# EAGLE design ATA (EAGLE 9.6.2)

## Sheet 1 of 2
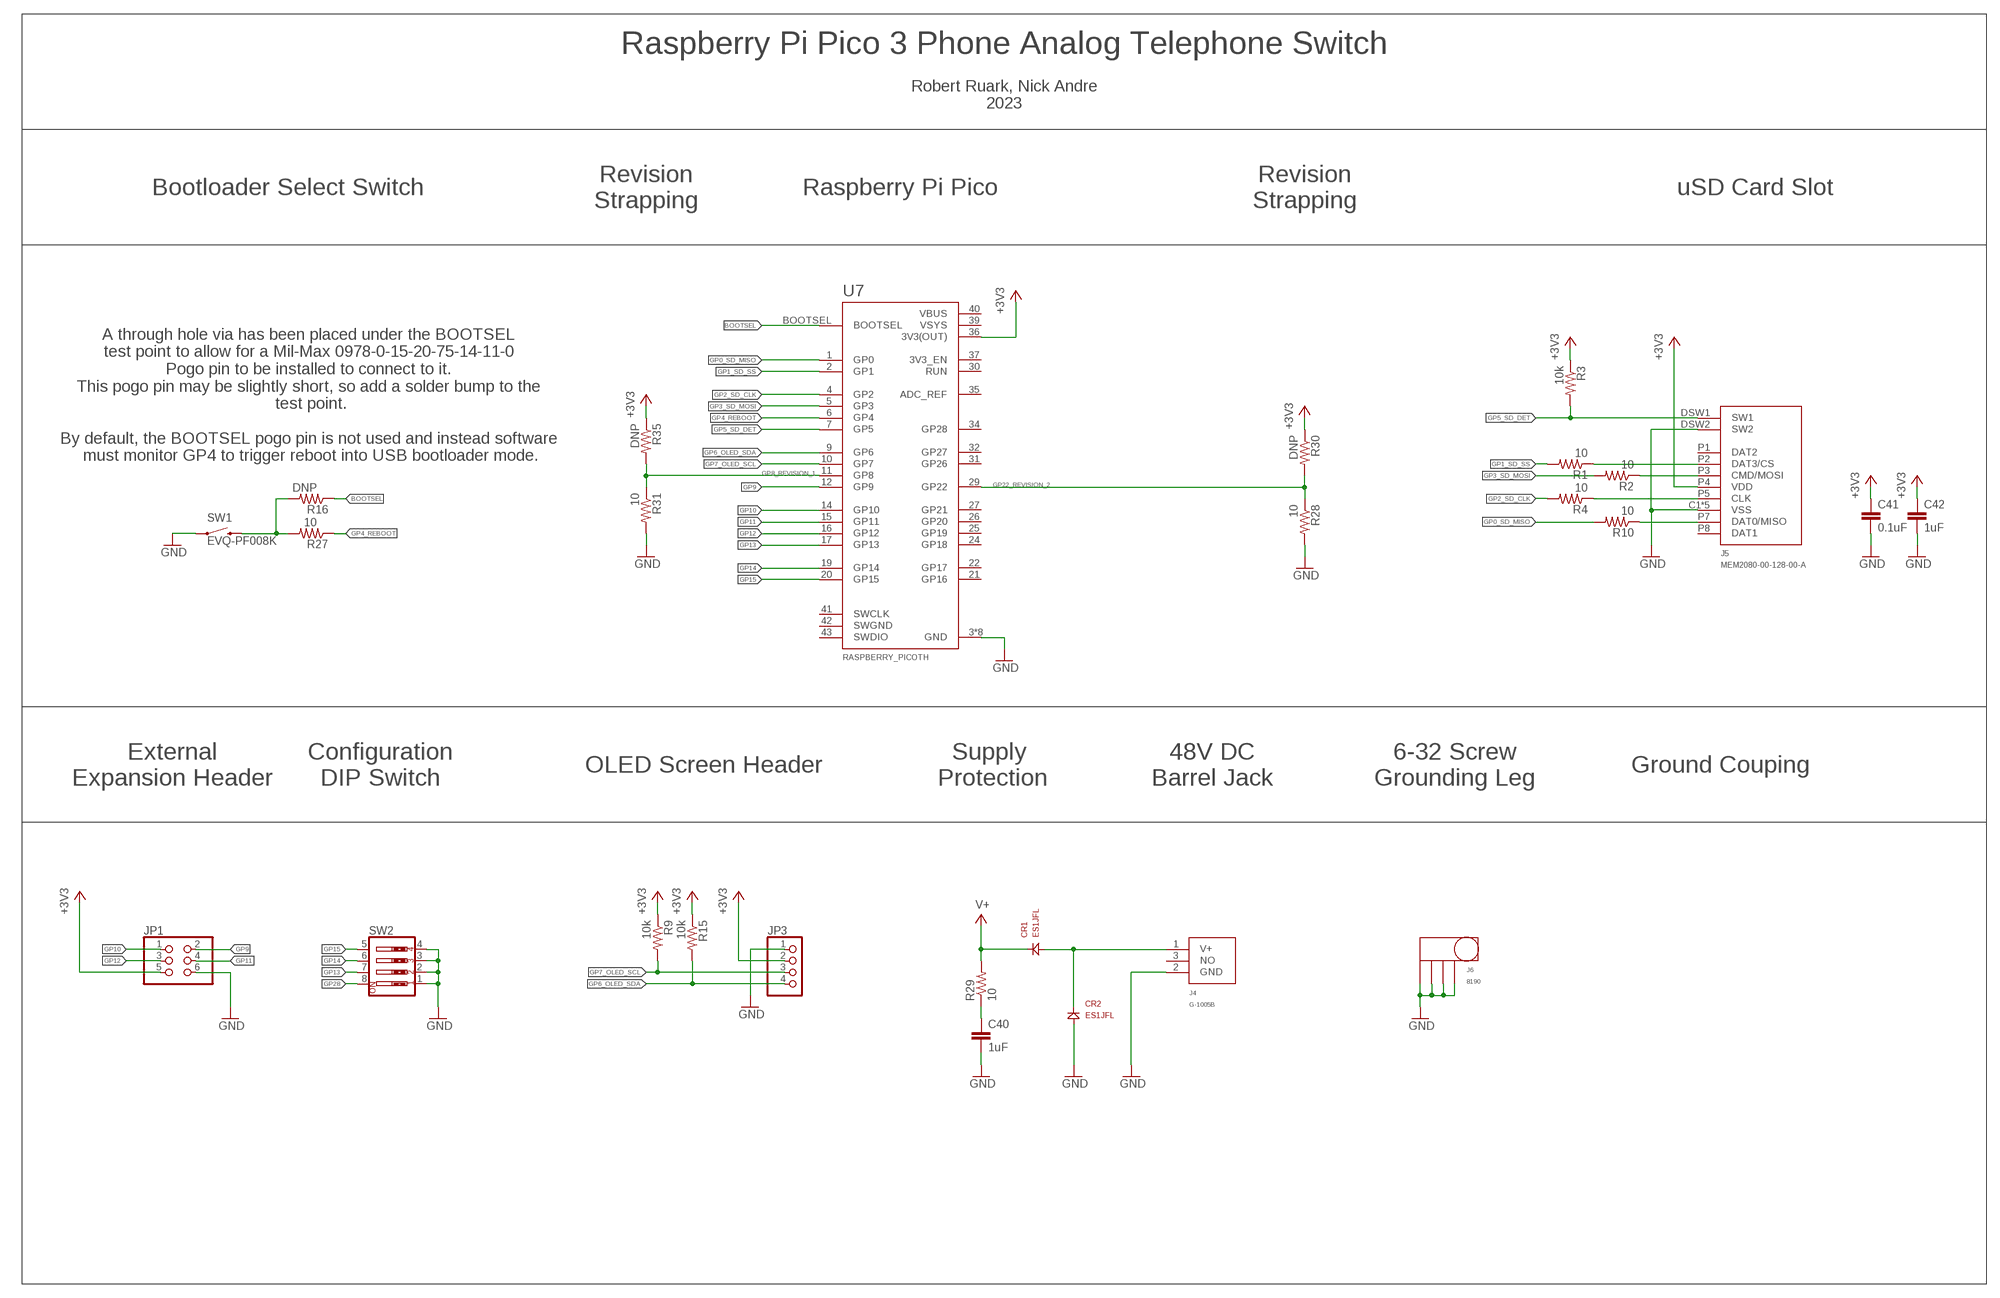
[diagram p0: schematic, sheet 1]

### Parts
C40  1uF  1206_CAPACITOR  [1206]
C41  0.1uF  0603_CAPACITOR  [0603]
C42  1uF  0805_CAPACITOR  [0805]
CR1  ES1JFL  [SOD123(AK)]
CR2  ES1JFL  [SOD123(AK)]
J4  G-1005B  [G-1005B]
J5  MEM2080-00-128-00-A  [MEM2080]
J6  8190  [7781]
JP1  PINHD-2X3/90  [2X03/90]
JP3  PINHD-1X4  [1X04]
R1  10  0603_RESISTOR  [0603]
R2  10  0603_RESISTOR  [0603]
R3  10k  0603_RESISTOR  [0603]
R4  10  0603_RESISTOR  [0603]
R9  10k  0603_RESISTOR  [0603]
R10  10  0603_RESISTOR  [0603]
R15  10k  0603_RESISTOR  [0603]
R16  DNP  0603_RESISTOR  [0603]
R27  10  0603_RESISTOR  [0603]
R28  10  0603_RESISTOR  [0603]
R29  10  1206_RESISTOR  [1206]
R30  DNP  0603_RESISTOR  [0603]
R31  10  0603_RESISTOR  [0603]
R35  DNP  0603_RESISTOR  [0603]
SW1  EVQ-PF008K  [EVQ-PF008K]
SW2  SW_DIP-4  [EDG-04]
U7  RASPBERRY_PICOTH  [PICO-PKG-TH]

### Nets
+3V3: C41.1 C42.1 J5.P4(VDD) JP1.5 JP3.2 R3.1 R9.1 R15.1 R30.1 R35.1 U7.36(3V3(OUT))
BOOTSEL: R16.1 U7.BOOTSEL
GND: C40.2 C41.2 C42.2 CR2.A J4.2(GND) J5.C1(VSS) J5.C2(VSS) J5.C3(VSS) J5.C4(VSS) J5.DSW2(SW2) J5.P6(VSS) J6.P$1 J6.P$2 J6.P$3 J6.P$4 JP1.6 JP3.1 R28.2 R31.2 SW1.S1 SW2.1 SW2.2 SW2.3 SW2.4 U7.3(GND) U7.8(GND) U7.13(GND) U7.18(GND) U7.23(GND) U7.28(GND) U7.33(GND) U7.38(GND) ; also sheet 2
GP0_SD_MISO: R10.2 U7.1(GP0)
GP1_SD_SS: R1.2 U7.2(GP1)
GP2_SD_CLK: R4.2 U7.4(GP2)
GP3_SD_MOSI: R2.2 U7.5(GP3)
GP4_REBOOT: R27.1 U7.6(GP4)
GP5_SD_DET: J5.DSW1(SW1) R3.2 U7.7(GP5)
GP6_OLED_SDA: JP3.4 R15.2 U7.9(GP6)
GP7_OLED_SCL: JP3.3 R9.2 U7.10(GP7)
GP8_REVISION_1: R31.1 R35.2 U7.11(GP8)
GP9: JP1.2 U7.12(GP9)
GP10: JP1.1 U7.14(GP10)
GP11: JP1.4 U7.15(GP11)
GP12: JP1.3 U7.16(GP12)
GP13: SW2.7 U7.17(GP13)
GP14: SW2.6 U7.19(GP14)
GP15: SW2.5 U7.20(GP15)
GP22_REVISION_2: R28.1 R30.2 U7.29(GP22)
GP28: SW2.8
N$19: R16.2 R27.2 SW1.S2
N$20: CR1.A CR2.K J4.1(V+)
N$25: J5.P5(CLK) R4.1
N$27: C40.1 R29.1
N$28: J5.P7(DAT0/MISO) R10.1
N$30: J5.P3(CMD/MOSI) R2.1
N$31: J5.P2(DAT3/CS) R1.1
V+: CR1.K R29.2
Unconnected: J4.3(NO) J5.P1(DAT2) J5.P8(DAT1) U7.21(GP16) U7.22(GP17) U7.24(GP18) U7.25(GP19) U7.26(GP20) U7.27(GP21) U7.30(RUN) U7.31(GP26) U7.32(GP27) U7.34(GP28) U7.35(ADC_REF) U7.37(3V3_EN) U7.41(SWCLK) U7.43(SWDIO)

### Notes on the sheet
- Raspberry Pi Pico 3 Phone Analog Telephone Switch
- Robert Ruark, Nick Andre
  2023
- Bootloader Select Switch
- Revision
  Strapping
- Raspberry Pi Pico
- Revision
  Strapping
- uSD Card Slot
- A through hole via has been placed under the BOOTSEL 
  test point to allow for a Mil-Max 0978-0-15-20-75-14-11-0 
  Pogo pin to be installed to connect to it. 
  This pogo pin may be slightly short, so add a solder bump to the 
  test point.
  
  By default, the BOOTSEL pogo pin is not used and instead software 
  must monitor GP4 to trigger reboot into USB bootloader mode.
- External
  Expansion Header
- Configuration
  DIP Switch
- OLED Screen Header
- Supply 
  Protection
- 48V DC
  Barrel Jack
- 6-32 Screw
  Grounding Leg
- Ground Couping

## Sheet 2 of 2
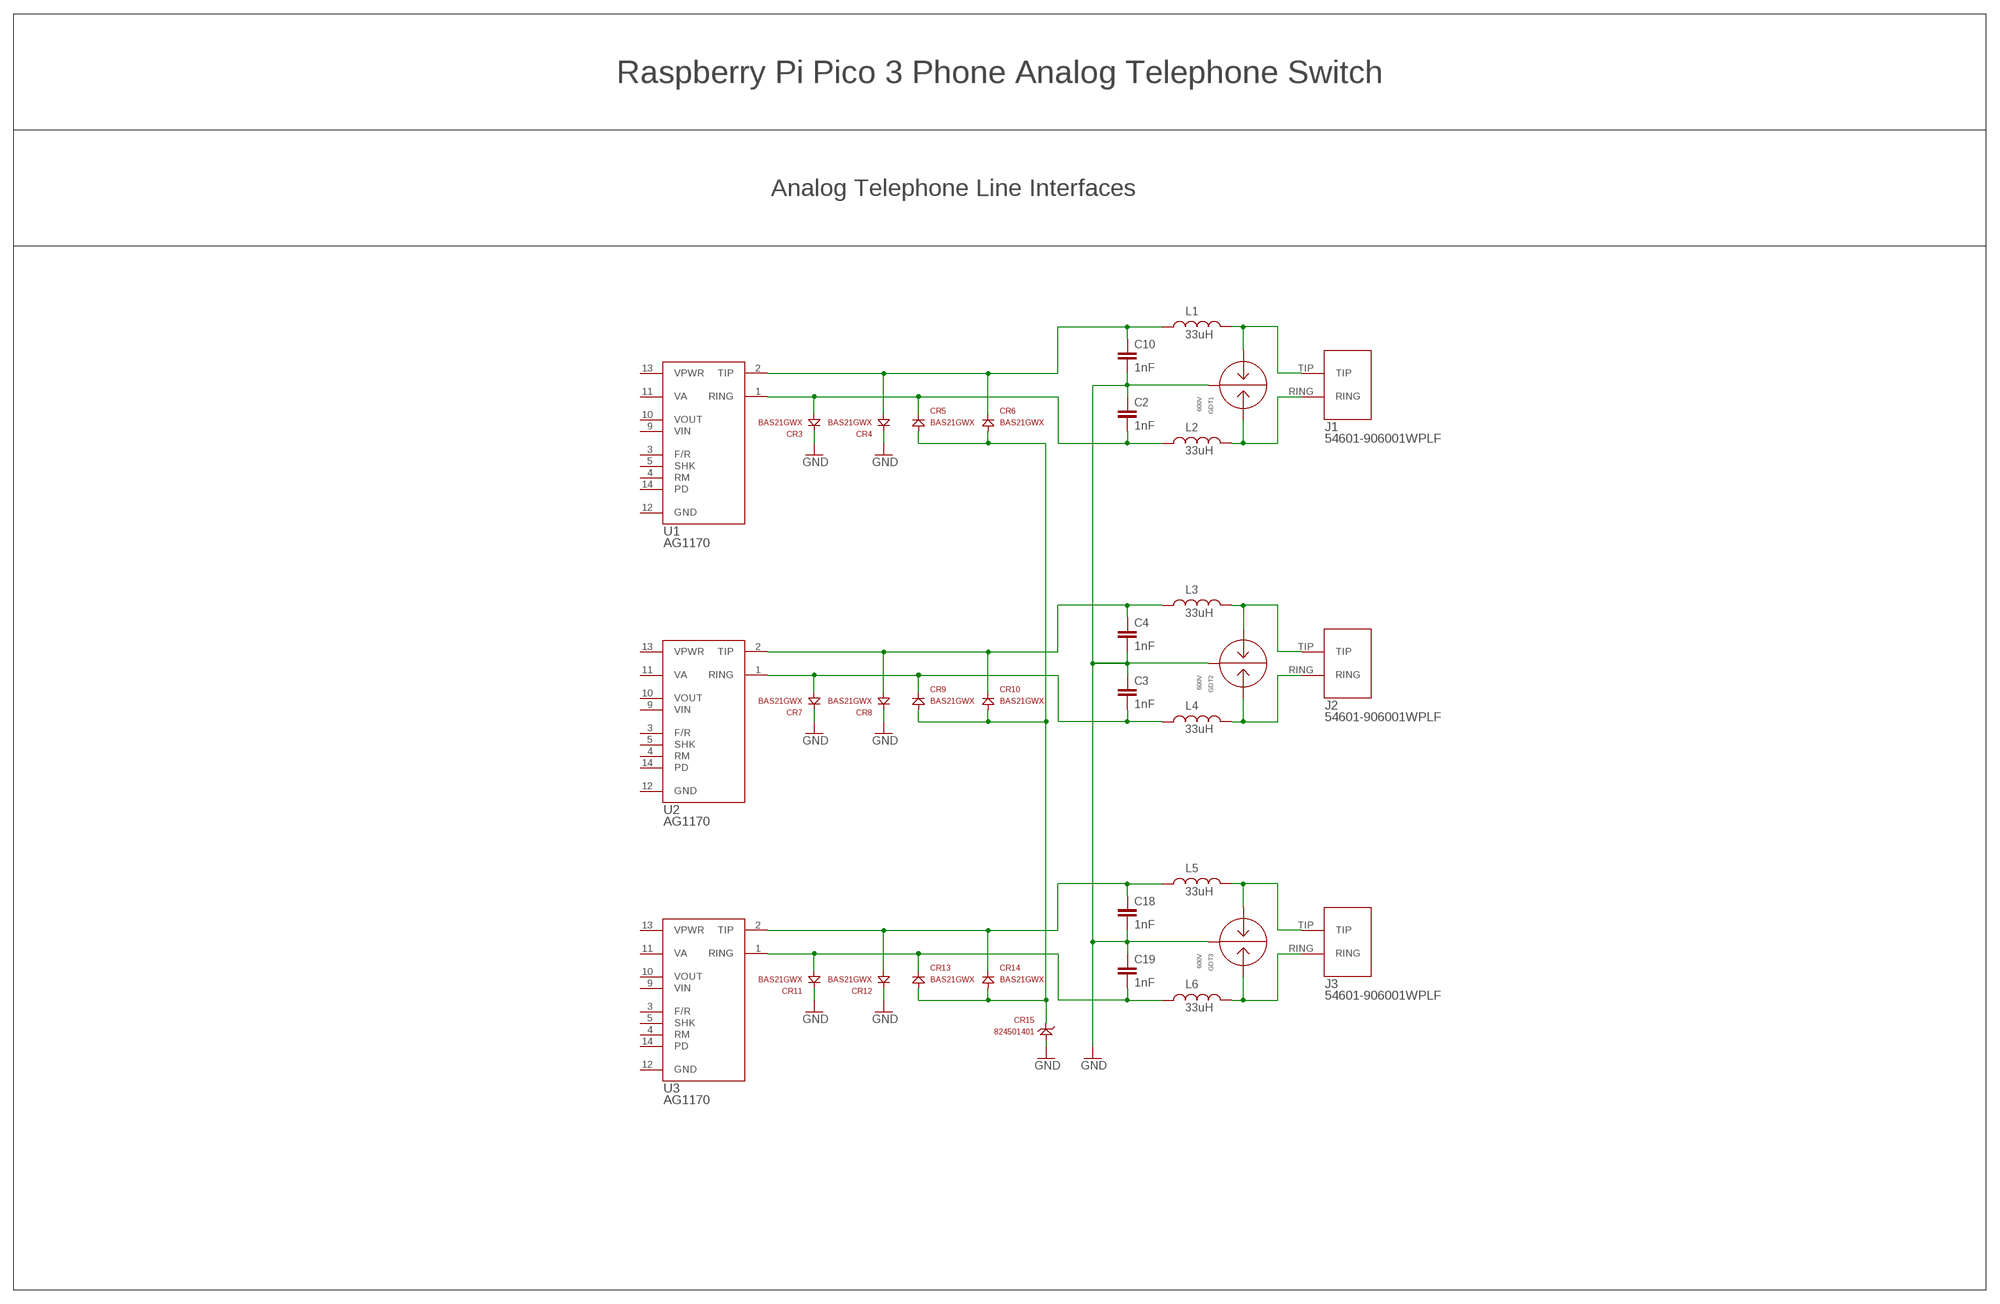
[diagram p1: schematic, sheet 2]

### Parts
C2  1nF  0805_CAPACITOR  [0805]
C3  1nF  0805_CAPACITOR  [0805]
C4  1nF  0805_CAPACITOR  [0805]
C10  1nF  0805_CAPACITOR  [0805]
C18  1nF  0805_CAPACITOR  [0805]
C19  1nF  0805_CAPACITOR  [0805]
CR3  BAS21GWX  [SOD123]
CR4  BAS21GWX  [SOD123]
CR5  BAS21GWX  [SOD123]
CR6  BAS21GWX  [SOD123]
CR7  BAS21GWX  [SOD123]
CR8  BAS21GWX  [SOD123]
CR9  BAS21GWX  [SOD123]
CR10  BAS21GWX  [SOD123]
CR11  BAS21GWX  [SOD123]
CR12  BAS21GWX  [SOD123]
CR13  BAS21GWX  [SOD123]
CR14  BAS21GWX  [SOD123]
CR15  824501401  [DO-214AC]
GDT1  600V  2036-60-SM-RPLF  [2036_GDT]
GDT2  600V  2036-60-SM-RPLF  [2036_GDT]
GDT3  600V  2036-60-SM-RPLF  [2036_GDT]
J1  54601-906001WPLF  [54601-906001WPLF]
J2  54601-906001WPLF  [54601-906001WPLF]
J3  54601-906001WPLF  [54601-906001WPLF]
L1  33uH  SDR0403-330KL  [SDR0403]
L2  33uH  SDR0403-330KL  [SDR0403]
L3  33uH  SDR0403-330KL  [SDR0403]
L4  33uH  SDR0403-330KL  [SDR0403]
L5  33uH  SDR0403-330KL  [SDR0403]
L6  33uH  SDR0403-330KL  [SDR0403]
U1  AG1170  [AG1170S]
U2  AG1170  [AG1170S]
U3  AG1170  [AG1170S]

### Nets
DNVT_1_SWITCH_RX_GREEN: GDT2.L2 J2.RING L4.2
DNVT_1_SWITCH_RX_GREEN-WHITE: GDT2.L1 J2.TIP L3.2
DNVT_1_SWITCH_TX_BLUE: GDT1.L2 J1.RING L2.2
DNVT_1_SWITCH_TX_BLUE-WHITE: GDT1.L1 J1.TIP L1.2
DNVT_2_SWITCH_TX_ORANGE: GDT3.L2 J3.RING L6.2
DNVT_2_SWITCH_TX_ORANGE-WHITE: GDT3.L1 J3.TIP L5.2
GND: C2.1 C3.1 C4.2 C10.2 C18.2 C19.1 CR3.1(K) CR4.1(K) CR7.1(K) CR8.1(K) CR11.1(K) CR12.1(K) CR15.A GDT1.C GDT2.C GDT3.C ; also sheet 1
N$1: C10.1 CR4.2(A) CR6.1(K) L1.1 U1.2(TIP)
N$2: C2.2 CR3.2(A) CR5.1(K) L2.1 U1.1(RING)
N$3: C4.1 CR8.2(A) CR10.1(K) L3.1 U2.2(TIP)
N$4: C3.2 CR7.2(A) CR9.1(K) L4.1 U2.1(RING)
N$12: CR5.2(A) CR6.2(A) CR9.2(A) CR10.2(A) CR13.2(A) CR14.2(A) CR15.C(K)
N$63: C18.1 CR12.2(A) CR14.1(K) L5.1 U3.2(TIP)
N$64: C19.2 CR11.2(A) CR13.1(K) L6.1 U3.1(RING)
Unconnected: U1.3(F/R) U1.4(RM) U1.5(SHK) U1.9(VIN) U1.10(VOUT) U1.11(VA) U1.12(GND) U1.13(VPWR) U1.14(PD) U2.3(F/R) U2.4(RM) U2.5(SHK) U2.9(VIN) U2.10(VOUT) U2.11(VA) U2.12(GND) U2.13(VPWR) U2.14(PD) U3.3(F/R) U3.4(RM) U3.5(SHK) U3.9(VIN) U3.10(VOUT) U3.11(VA) U3.12(GND) U3.13(VPWR) U3.14(PD)

### Notes on the sheet
- Raspberry Pi Pico 3 Phone Analog Telephone Switch
- Analog Telephone Line Interfaces

## Power pins joined to a net without a drawn wire
SWGND: U7.42(SWGND)
VBUS: U7.40(VBUS)
VSYS: U7.39(VSYS)

## Library data of the parts
C2-C4 C10 C18 C19 C42 = ruark2:0805_CAPACITOR: NO DEFINED PN
C40 = ruark2:1206_CAPACITOR: NO DEFINED PN; VALUE: sel
C41 = ruark2:0603_CAPACITOR: 0603 Capacitor -- WARNING: NO DEFINED VALUE OR PART NUMBER; VALUE: sel
CR1 CR2 = ruark2:ES1JFL: Diode Standard 600 V 1A Surface Mount SOD-123F; PARTNO: ES1JFLCT-ND
CR3-CR14 = ruark2:BAS21GWX: Diode Standard 200V 225mA (DC) Surface Mount SOD-123; PARTNO: 1727-7323-1-ND
CR15 = ruark2:824501401: 64.5V Clamp 6.1A Ipp Tvs Diode Surface Mount DO-214AC; PARTNO: 732-9960-1-ND
GDT1-GDT3 = ruark2:2036-60-SM-RPLF: Gas Discharge Tube 600 V 10000A (10kA) ±20% 3 Pole Surface Mount LCSC Knockoff SE90-600X; PARTNO: 2036-60-SM-RPLFCT-ND
J1-J3 = ruark2:54601-906001WPLF: Jack Modular Connector 6p2c (RJ11) 90° Angle (Right) Unshielded Cat3; PARTNO: 609-5354-ND
J4 = ruark2:G-1005B: Power Barrel Connector Jack 2.50mm ID (0.098"), 5.50mm OD (0.217") Through Hole, Right Angle; PARTNO: 1939-G-1005B-ND
J5 = ruark2:MEM2080-00-128-00-A: 9 (8 + 1) Position Card Connector Secure Digital - microSD™ Surface Mount, Right Angle Gold; PARTNO: 2073-MEM2080-00-128-00-ACT-ND
J6 = ruark2:8190: 4 Pin Screw Terminal, Power Tap 6-32 Through Hole, Right Angle; PARTNO: 36-8190-ND
JP1 = pinhead:PINHD-2X3: PIN HEADER
JP3 = pinhead:PINHD-1X4: PIN HEADER
L1-L6 = ruark2:SDR0403-330KL: 33 µH Unshielded Drum Core, Wirewound Inductor 640 mA 540mOhm Max Nonstandard LCSC knockoff: SM4532-330MT; PARTNO: SDR0403-330KLCT-ND
R1-R4 R9 R10 R15 R16 R27 R28 R30 R31 R35 = ruark2:0603_RESISTOR: 0603 Resistor -- WARNING: NO DEFINED PART NUMBER OR VALUE; VALUE: sel
R29 = ruark2:1206_RESISTOR: NO DEFINED PN; VALUE: sel
SW1 = ruark2:EVQ-PF008K: Tactile Switch SPST-NO Side Actuated Through Hole, Right Angle; PARTNO: P10880S-ND
SW2 = special:SW_DIP-4: DIP SWITCH
U1-U3 = ruark2:AG1170: Aliexpress SLIC
U7 = ruark2:RASPBERRY_PICO: Raspberry Pi Pico

## Net classes
1 HV: clearance 0.406 mm

## Board
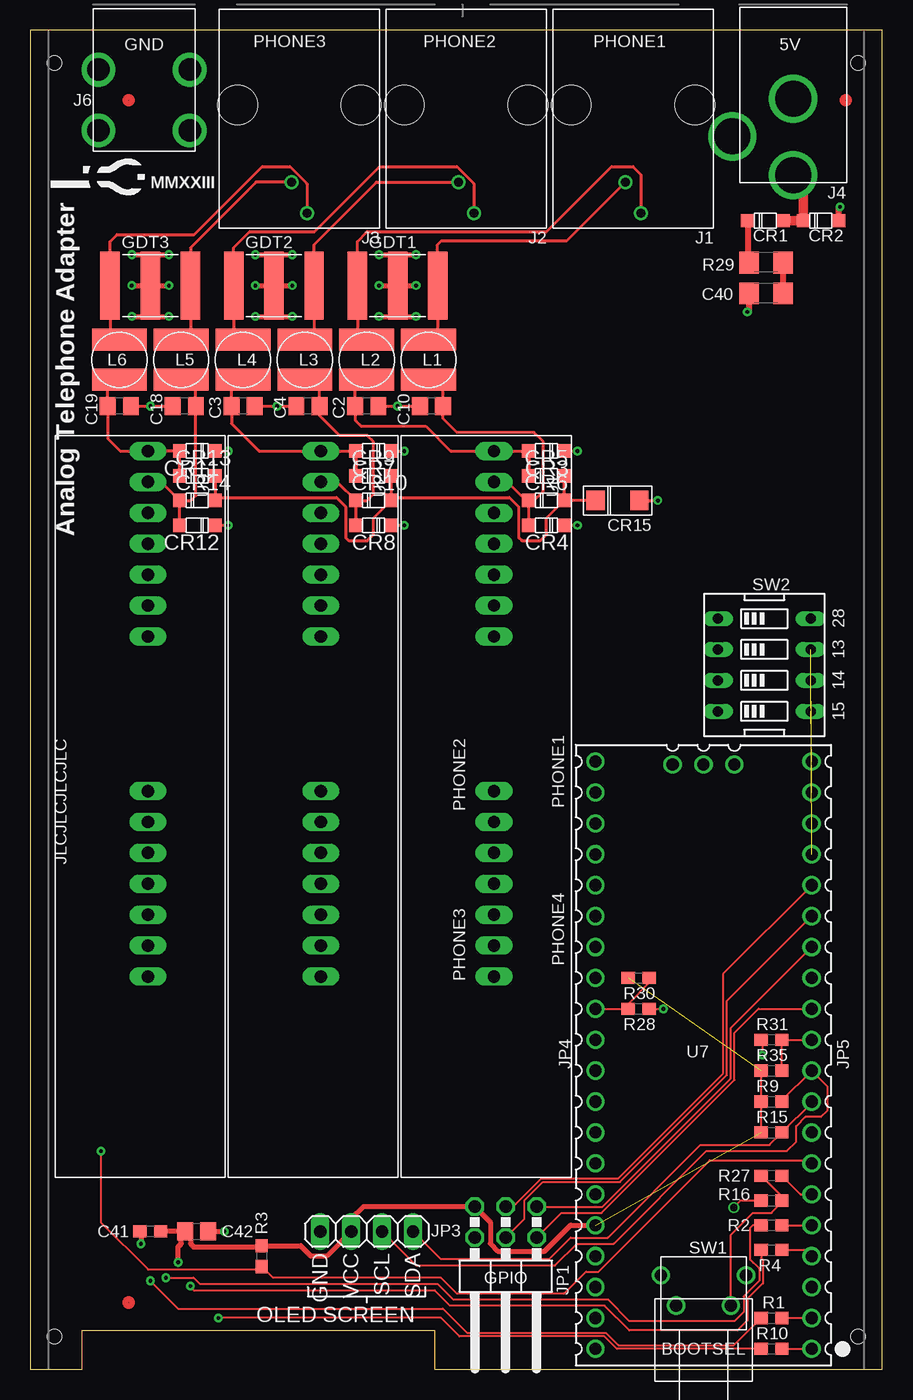
[diagram p2: board, top side]
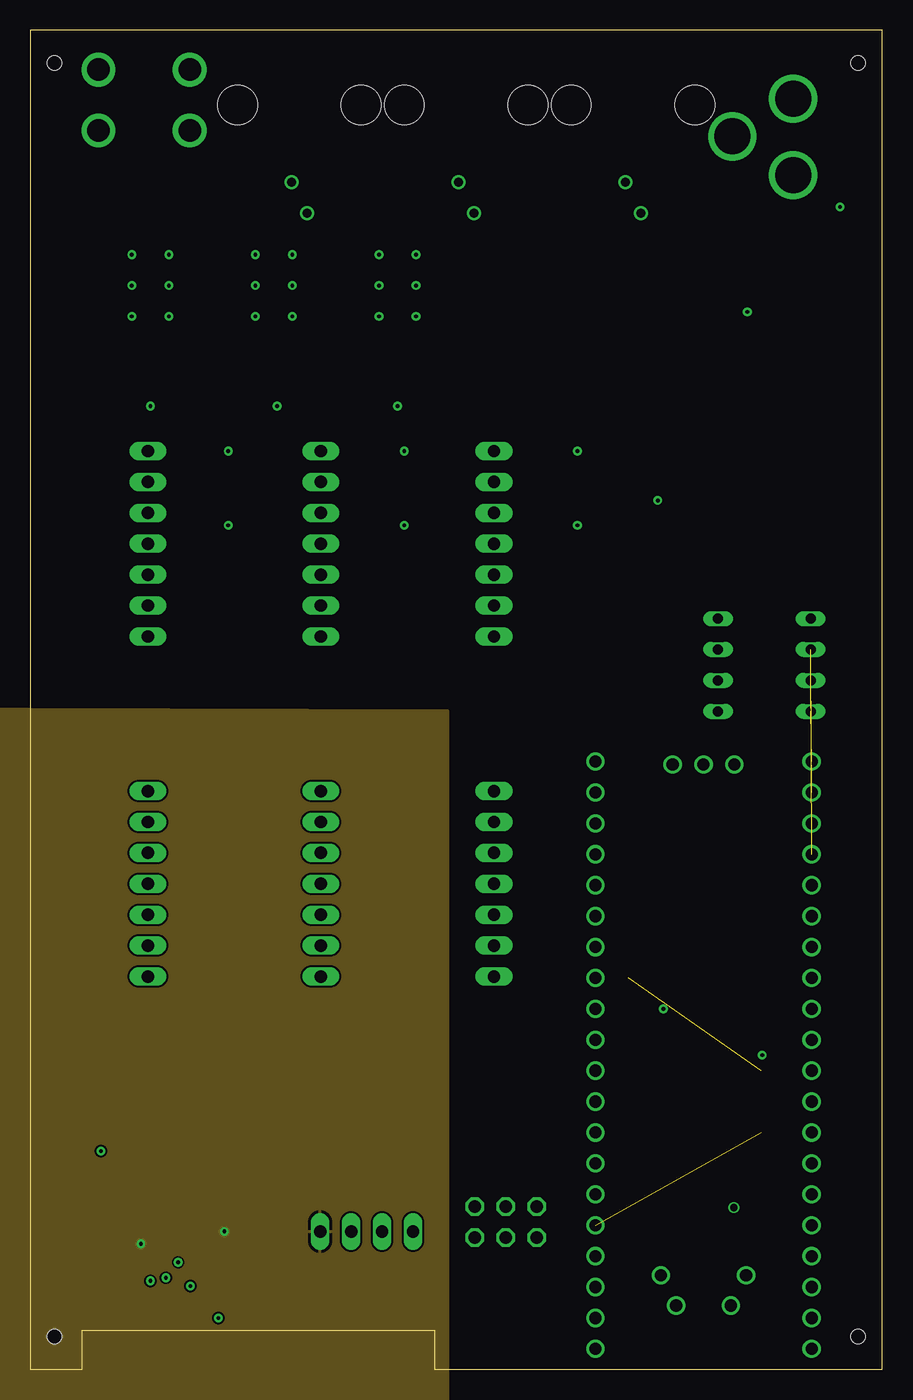
[diagram p3: board, inner layer Route2]
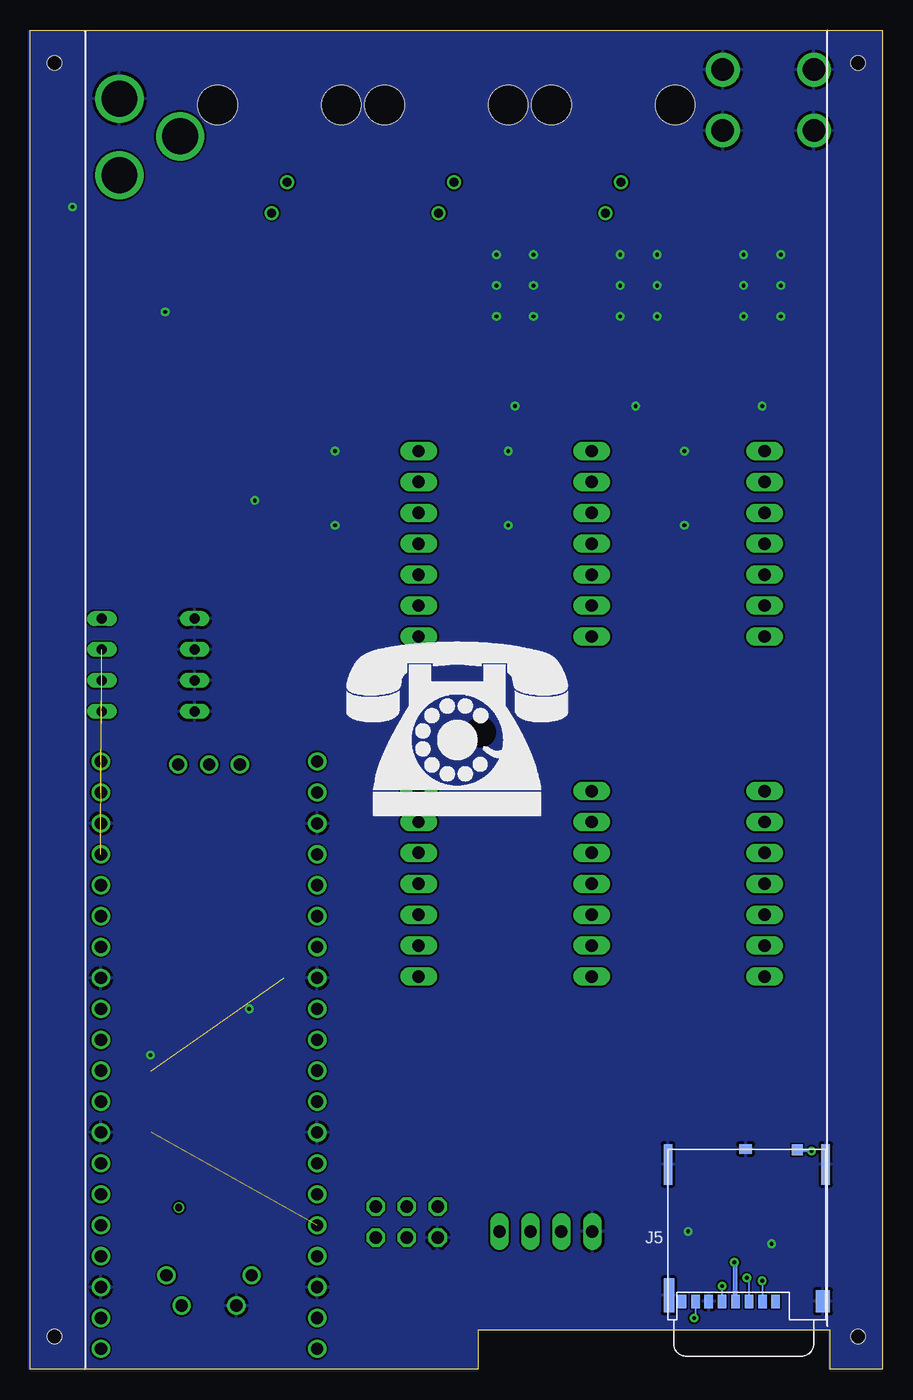
[diagram p4: board, bottom side, seen from below]

Size 70 x 110 mm. Coordinates in mm from the lower left corner, seen from the top.
Outline: 0,0 4.27,0 4.27,3.18 33.22,3.18 33.22,0 70,0 70,110 0,110 0,0
Copper layers (1*16): Top 0.035mm / dielectric 1.5mm / Bottom 0.035mm
Design rules "default *": minimum track width 6mil, minimum drill 12mil, track to track 6mil, track to pad 6mil, pad to pad 6mil, via to via 6mil, smd to smd 6mil, copper to edge 0mil, drill to drill 6mil, minimum pad ring 0.13mm, minimum via ring 8mil, stop-mask expansion 4mil, vias tented up to drill 12mil, thermal gap 10mil
Holes 1.15 mm at 1.98,107.32 68.02,107.32 1.98,2.68 68.02,2.68
tRestrict: area 7,103.2 to 9.2,105.4; area 65.9,103.2 to 68.1,105.4; area 7,4.4 to 9.2,6.6; area 1,106.3 to 3,108.3; area 67,106.3 to 69,108.3; area 67,1.7 to 69,3.7; area 1,1.7 to 3,3.7
bRestrict: area -34,51.3 to -32,53.3; area 32,51.3 to 34,53.3; area 32,-53.3 to 34,-51.3; area -34,-53.3 to -32,-51.3

### Footprints (pad centres in the part's own frame; a part is rotated, then mirrored left to right if it is on the bottom)
0805 = smd 1.3 x 1.5: 1 -0.95,0; 2 0.95,0
1206 = smd 1.6 x 1.8: 1 -1.4,0; 2 1.4,0
0603 = smd 1.1 x 1: 1 -0.85,0; 2 0.85,0
SOD123(AK) = smd 1.1 x 1.1: A 1.45,0; K -1.45,0
SOD123 = smd 1.1 x 1.1: 1 -1.45,0; 2 1.45,0
DO-214AC = smd 1.5 x 1.6: A -1.8,0; C 1.8,0
2036_GDT = smd 1.6 x 5.6: C 0,0; L1 -3.3,0; L2 3.3,0
54601-906001WPLF = drill 0.76: RING -0.64,16.77; TIP 0.63,14.23 | hole 3.25: -5.08,7.88; 5.08,7.88
G-1005B = drill 2.95: 1 0,13.8; 2 0,7.5; 3 5,10.6
MEM2080 = smd 1.14 x 1.83: C1 -6.26,6 | smd 0.86 x 2.8: C2 6.4,5.515 | smd 0.7 x 3.33: C3 -6.48,-5.25; C4 6.48,-5.25 | smd 0.9 x 0.93: DSW1 -4.17,-6.45 | smd 1.05 x 0.78: DSW2 0.095,-6.525 | smd 0.7 x 1.1: P1 -2.38,6.015; P2 -1.28,6.015; P3 -0.18,6.015; P4 0.92,6.015; P5 2.02,6.015; P6 3.12,6.015; P7 4.22,6.015; P8 5.32,6.015
7781 = drill 1.85: P$1 -3.75,2.5; P$2 3.75,2.5; P$3 -3.75,-2.5; P$4 3.75,-2.5
2X03/90 = drill 1.016 octagon: 1 -2.54,-6.35; 2 -2.54,-3.81; 3 0,-6.35; 4 0,-3.81; 5 2.54,-6.35; 6 2.54,-3.81
1X04 = drill 1.016 long: 1 -3.81,0; 2 -1.27,0; 3 1.27,0; 4 3.81,0
SDR0403 = smd 4.5 x 1.8: 1 0,1.65; 2 0,-1.65
EVQ-PF008K = drill 1: NC1 -3.5,2.5; NC2 3.5,2.5; S1 -2.25,0; S2 2.25,0
EDG-04 = drill 0.813 long: 1 -3.81,-3.81; 2 -1.27,-3.81; 3 1.27,-3.81; 4 3.81,-3.81; 5 3.81,3.81; 6 1.27,3.81; 7 -1.27,3.81; 8 -3.81,3.81
AG1170S = drill 1.016 long: 1 -1.27,0; 2 -3.81,0; 3 -6.35,0; 4 -8.89,0; 5 -11.43,0; 6 -13.97,0; 7 -16.51,0; 8 -29.21,0; 9 -31.75,0; 10 -34.29,0; 11 -36.83,0; 12 -39.37,0; 13 -41.91,0; 14 -44.45,0
PICO-PKG-TH = drill 1: 1 -8.89,24.13; 2 -8.89,21.59; 3 -8.89,19.05; 4 -8.89,16.51; 5 -8.89,13.97; 6 -8.89,11.43; 7 -8.89,8.89; 8 -8.89,6.35; 9 -8.89,3.81; 10 -8.89,1.27; 11 -8.89,-1.27; 12 -8.89,-3.81; 13 -8.89,-6.35; 14 -8.89,-8.89; 15 -8.89,-11.43; 16 -8.89,-13.97; 17 -8.89,-16.51; 18 -8.89,-19.05; 19 -8.89,-21.59; 20 -8.89,-24.13; 21 8.89,-24.13; 22 8.89,-21.59; 23 8.89,-19.05; 24 8.89,-16.51; 25 8.89,-13.97; 26 8.89,-11.43; 27 8.89,-8.89; 28 8.89,-6.35; 29 8.89,-3.81; 30 8.89,-1.27; 31 8.89,1.27; 32 8.89,3.81; 33 8.89,6.35; 34 8.89,8.89; 35 8.89,11.43; 36 8.89,13.97; 37 8.89,16.51; 38 8.89,19.05; 39 8.89,21.59; 40 8.89,24.13; 41 -2.54,-23.9; 42 0,-23.9; 43 2.54,-23.9 | drill 0.584: BOOTSEL -2.489,12.522

### Placement (x,y rotation side)
C2  27.63,79.13 180 top
C3  17.47,79.13 180 top
C4  22.81,79.13 180 top
C10  32.97,79.13 180 top
C18  12.65,79.13 180 top
C19  7.31,79.13 180 top
C40  60.45,88.39 180 top
C41  9.85,11.31 180 top
C42  13.66,11.31 0 top
CR1  60.4,94.37 0 top
CR2  64.97,94.37 0 top
CR3  42.42,75.44 180 top
CR4  42.42,69.34 180 top
CR5  42.42,73.41 0 top
CR6  42.42,71.37 0 top
CR7  28.19,75.44 180 top
CR8  28.19,69.34 180 top
CR9  28.19,73.41 0 top
CR10  28.19,71.37 0 top
CR11  13.72,75.44 180 top
CR12  13.72,69.34 180 top
CR13  13.72,73.41 0 top
CR14  13.72,71.37 0 top
CR15  48.26,71.37 180 top
GDT1  30.17,89.04 180 top
GDT2  20.01,89.04 180 top
GDT3  9.85,89.04 180 top
J1  49.53,111.76 180 top
J2  35.81,111.76 180 top
J3  22.1,111.76 180 top
J4  62.69,111.9 180 top
J5  11.12,11.57 180 bottom
J6  9.35,104.28 0 top
JP1  39.06,6.99 180 top
JP3  27.63,11.31 0 top
L1  32.71,82.94 180 top
L2  27.63,82.94 180 top
L3  22.55,82.94 180 top
L4  17.47,82.94 180 top
L5  12.39,82.94 180 top
L6  7.31,82.94 180 top
R1  60.91,4.2 0 top
R2  60.91,11.82 0 top
R3  19,9.28 270 top
R4  60.91,9.79 0 top
R9  60.91,21.98 0 top
R10  60.91,1.66 0 top
R15  60.91,19.44 0 top
R16  60.91,13.85 0 top
R27  60.91,15.88 180 top
R28  49.99,29.6 0 top
R29  60.45,90.93 180 top
R30  49.99,32.14 0 top
R31  60.91,27.06 180 top
R35  60.91,24.52 0 top
SW1  55.32,5.22 0 top
SW2  60.32,57.86 270 top
U1  38.1,76.71 90 top
U2  23.88,76.71 90 top
U3  9.65,76.71 90 top
U7  55.32,25.79 180 top

### Tracks (layer width: path | path; a pad name or v marks a point on that pad's centre or on a via)
+3V3  (via drill 0.3)  (2 unrouted)
  Top 0.152: R15.1 R9.1 R35.1
  Top 0.406: U7.36 44.4,11.82 42.26,9.69 38.4,9.69 37.79,10.3 37.79,12.07 JP1.5 27.38,13.34 26.36,12.33 JP3.2 24.33,9.28 23.06,9.28 22.21,10.13 R3.1 18.91,10.04 13.41,10.04 13.16,10.3 13.16,10.87 C42.1 12.39,11.31 | 12.39,11.31 C41.1 | v12.14,8.77 12.14,10.04 12.39,10.3 12.39,11.31
  Bottom 0.406: J5.P4 12.04,8.68 v12.14,8.77
BOOTSEL
  Top 0.152: U7.BOOTSEL 58.39,13.85 R16.1
DNVT_1_SWITCH_RX_GREEN
  Top 0.254: L4.2 16.84,84.59 16.71,84.72 GDT2.L2 16.71,92.15 18.03,93.47 23.37,93.47 28.7,98.81 35.05,98.81 36.45,97.4 J2.RING
DNVT_1_SWITCH_RX_GREEN-WHITE
  Top 0.254: L3.2 22.68,84.46 23.32,84.46 23.31,84.47 GDT2.L1 23.31,92.4 28.44,97.53 J2.TIP
DNVT_1_SWITCH_TX_BLUE
  Top 0.254: L2.2 27.51,84.46 26.87,84.46 26.87,84.47 GDT1.L2 26.87,92.66 27.69,93.47 42.42,93.47 47.75,98.81 49.53,98.81 50.17,98.17 J1.RING
DNVT_1_SWITCH_TX_BLUE-WHITE
  Top 0.254: L1.2 32.71,83.96 32.84,83.83 33.48,84.46 33.47,84.47 GDT1.L1 33.47,92.4 33.78,92.71 44.08,92.71 J1.TIP
DNVT_2_SWITCH_TX_ORANGE
  Top 0.254: L6.2 7.19,84.46 6.55,84.46 6.55,84.47 GDT3.L2 6.55,92.66 7.11,93.22 13.46,93.22 19.05,98.81 21.34,98.81 22.74,97.4 J3.RING
DNVT_2_SWITCH_TX_ORANGE-WHITE
  Top 0.254: L5.2 12.39,83.96 12.52,83.83 13.16,84.46 13.15,84.47 GDT3.L1 13.15,92.15 18.54,97.53 J3.TIP
GND  (via drill 0.3)
  Top 0.152: R28.2 v52.02,29.6 | R31.2 60.15,26.97 v60.15,25.79
  Top 0.254: C3.1 v20.27,79.13 C4.2 | C2.1 v30.17,79.13 C10.2 | C19.1 v9.85,79.13 C18.2 | CR8.1 v30.73,69.34 | CR12.1 v16.26,69.34 | CR11.1 v16.26,75.44 | CR7.1 v30.73,75.44 | CR3.1 v44.96,75.44 | CR4.1 v44.96,69.34 | CR15.A v51.56,71.37
  Top 0.406: C42.2 v15.95,11.31 | C41.2 9.09,11.22 v9.09,10.3 | v21.54,89.04 GDT2.C v18.49,89.04 | v31.7,89.04 GDT1.C v28.65,89.04 | v11.38,89.04 GDT3.C v8.33,89.04 | v8.33,91.58 v11.38,91.58 | v8.33,86.5 v11.38,86.5 | v18.49,91.58 v21.54,91.58 | v28.65,91.58 v31.7,91.58 | v28.65,86.5 v31.7,86.5 | v18.49,86.5 v21.54,86.5
  Top 0.508: C40.2 59.05,86.99 v58.93,86.87 | CR2.A 66.42,95.38 v66.55,95.5
  pour Route2: -34.29,54.36 34.29,54.1 34.29,-54.36 -34.29,-54.1
  pour Bottom: 0,0 4.32,0 4.32,3.3 33.27,3.3 33.27,0 70.1,0 70.1,109.98 0,109.98
GP0_SD_MISO
  Top 0.152: R10.2 U7.1
GP1_SD_SS
  Top 0.152: R1.2 U7.2
GP2_SD_CLK
  Top 0.152: R4.2 63.7,9.79 U7.4
GP3_SD_MOSI
  Top 0.152: R2.2 U7.5
GP4_REBOOT
  Top 0.152: R27.1 63.28,14.36 U7.6
GP5_SD_DET  (via drill 0.3)
  Top 0.152: v5.79,17.92 5.79,12.07 9.68,8.19 18.82,8.19 19,8.01 R3.2 19.93,7.5 33.73,7.5 35,6.23 43.89,6.23 45.67,8.01 46.68,8.01 55.83,17.15 63.96,17.15 U7.7
  Bottom 0.152: J5.DSW1 6.85,17.92 v5.79,17.92
GP6_OLED_SDA
  Top 0.152: U7.9 64.21,21.89 R15.2 60.74,18.42 55.07,18.42 47.45,10.8 44.4,10.8 42.62,9.03 33.73,9.03 JP3.4
GP7_OLED_SCL
  Top 0.152: R9.2 61.76,22.07 U7.10 65.48,23.25 65.48,21.22 64.97,20.71 63.7,20.71 62.94,19.95 62.94,18.68 62.18,17.92 55.57,17.92 47.95,10.3 44.91,10.3 43.13,8.52 31.7,8.52 JP3.3
GP8_REVISION_1
  Top 0.152: R35.2 R31.1 U7.11
GP9
  Top 0.152: JP1.2 43.64,12.84 46.94,12.84 57.86,23.76 57.86,27.63 59.83,29.6 U7.12
GP10
  Top 0.152: JP1.1 47.02,13.34 57.55,23.88 57.55,28.02 U7.14
GP11
  Top 0.152: JP1.4 40.59,12.33 40.59,13.85 42.11,15.38 48.46,15.38 57.25,24.16 57.25,30.26 U7.15
GP12
  Top 0.152: JP1.3 39.65,13.34 41.99,15.68 48.34,15.68 56.95,24.29 56.95,32.5 U7.16
GP13  (1 unrouted)
GP14  (1 unrouted)
GP15  (1 unrouted)
GP22_REVISION_2
  Top 0.152: R30.2 50.84,31.72 49.14,30.02 R28.1 U7.29
N$1
  Top 0.254: L1.1 33.6,81.29 33.92,80.97 C10.1 33.92,78.1 35.05,76.96 41.4,76.96 42.16,76.2 42.16,72.14 41.4,71.37 CR6.1 40.97,71.12 | CR4.2 40.97,71.12 | U1.2 39.19,72.9 40.97,71.12
N$2
  Top 0.254: C2.2 27.13,79.57 | L2.1 27.25,81.29 26.68,80.72 C2.2 | C2.2 26.68,77.96 27.18,77.47 32.51,77.47 34.54,75.44 U1.1 CR3.2 CR5.1
N$3
  Top 0.254: L3.1 22.68,81.42 23.32,81.42 23.82,80.91 23.76,80.84 C4.1 23.76,78.35 25.4,76.71 27.69,76.71 28.19,76.2 28.19,71.88 27.69,71.37 CR10.1 | CR8.2 CR10.1 | U2.2 25.22,72.9 CR10.1
N$4
  Top 0.254: L4.1 16.84,81.29 16.52,80.97 C3.2 16.52,77.71 18.8,75.44 U2.1 CR7.2 CR9.1
N$12
  Top 0.254: CR13.2 CR14.2 15.42,71.63 25.15,71.63 25.91,70.87 25.91,68.33 26.16,68.07 27.69,68.07 28.19,68.58 28.19,69.92 CR10.2 | CR9.2 CR10.2 | CR10.2 29.9,71.63 39.37,71.63 40.13,70.87 40.13,68.33 40.39,68.07 41.91,68.07 42.42,68.58 42.42,69.92 CR6.2 | CR5.2 CR6.2 | CR15.C CR6.2
N$19
  Top 0.152: SW1.S2 57.57,11.02 59.38,12.84 60.91,12.84 61.76,13.69 R16.2 61.76,14.18 R27.2
N$20
  Top 0.762: CR1.A CR2.K 63.52,97.26 J4.1
N$25  (via drill 0.3)
  Top 0.152: R4.1 60.06,9.11 60.2,8.97 60.2,7.04 58.93,5.78 58.93,4 58.11,3.18 49.22,3.18 47.19,5.22 34.49,5.22 33.22,6.49 13.41,6.49 13.16,6.74 v13.16,6.82
  Bottom 0.152: v13.16,6.82 13.16,5.56 J5.P5
N$27
  Top 0.508: R29.1 C40.1
N$28  (via drill 0.3)
  Top 0.152: R10.1 48.21,1.66 47.19,2.68 35.25,2.68 33.73,4.2 v15.44,4.2
  Bottom 0.152: J5.P7 15.34,4.3 v15.44,4.2
N$30  (via drill 0.3)
  Top 0.152: R2.1 59.38,11.82 59.13,11.57 59.13,9.03 59.89,8.26 59.89,7.25 58.62,5.98 58.62,4.71 57.86,3.95 49.22,3.95 47.45,5.72 34.75,5.72 33.48,6.99 13.92,6.99 13.41,7.5 v11.12,7.5
  Bottom 0.152: v11.12,7.5 10.94,7.32 J5.P3
N$31  (via drill 0.3)
  Top 0.152: v9.85,7.25 12.14,4.96 33.91,4.96 35.89,2.98 47.32,2.98 48.33,1.97 57.82,1.97 R1.1
  Bottom 0.152: v9.85,7.25 9.85,5.56 J5.P2
N$63
  Top 0.254: L5.1 13.28,81.29 13.6,80.97 C18.1 13.6,71.76 13.21,71.37 CR14.1 | CR12.2 CR14.1 | U3.2 10.74,72.9 CR14.1
N$64
  Top 0.254: C19.2 6.81,79.57 | L6.1 6.93,81.29 6.36,80.72 C19.2 | CR13.1 CR11.2 U3.1 7.37,75.44 6.36,76.44 C19.2
V+
  Top 0.508: CR1.K 58.95,91.03 R29.2
(copper drawn outside any net)
  shapes: Top circle x3

### Text on the board
tPlace: GND | PHONE3 | PHONE2 | PHONE1 | 5V | MMXXIII | Analog Telephone Adapter | 28 | 13 | 14 | 15 | PHONE2 | PHONE1 | PHONE4 | PHONE3 | GND | VCC | SCL | SDA | GPIO | OLED SCREEN | BOOTSEL
tNames: JLCJLCJLCJLC | JP4 | JP5
tStop: 026